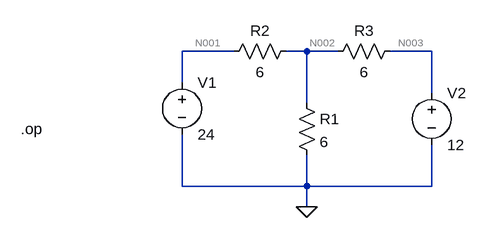
[diagram p0: schematic Draft1.asc]
Draft1.asc, the LTspice schematic file:
Version 4
SHEET 1 880 680
WIRE 128 32 48 32
WIRE 240 32 208 32
WIRE 288 32 240 32
WIRE 432 32 368 32
WIRE 48 80 48 32
WIRE 432 96 432 32
WIRE 240 112 240 32
WIRE 48 240 48 160
WIRE 240 240 240 192
WIRE 240 240 48 240
WIRE 432 240 432 176
WIRE 432 240 240 240
WIRE 240 272 240 240
FLAG 240 272 0
SYMBOL res 224 16 R90
WINDOW 0 0 56 VBottom 2
WINDOW 3 32 56 VTop 2
SYMATTR InstName R2
SYMATTR Value 6
SYMBOL res 384 16 R90
WINDOW 0 0 56 VBottom 2
WINDOW 3 32 56 VTop 2
SYMATTR InstName R3
SYMATTR Value 6
SYMBOL res 224 96 R0
SYMATTR InstName R1
SYMATTR Value 6
SYMBOL voltage 432 80 R0
SYMATTR InstName V2
SYMATTR Value 12
SYMBOL voltage 48 64 R0
SYMATTR InstName V1
SYMATTR Value 24
TEXT -200 152 Left 2 !.op

The netlist it stands for:
* Draft1.asc
R2 N002 N001 6
R3 N003 N002 6
R1 N002 0 6
V2 N003 0 12
V1 N001 0 24
.op
.backanno
.end

* Results of the author's LTspice run, read from the files saved beside the schematic
* Operating Point:
*   V(n002) = 12 V
*   V(n001) = 24 V
*   V(n003) = 12 V
*   I(R1) = 2 A
*   I(R3) = 0 A
*   I(R2) = -2 A
*   I(V1) = -2 A
*   I(V2) = 0 A